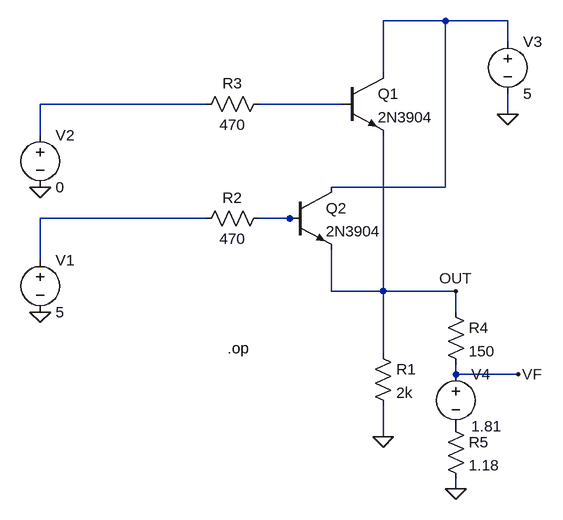
[diagram p0: schematic ORGATE.asc]
ORGATE.asc, the LTspice schematic file:
Version 4
SHEET 1 880 708
WIRE 400 -32 304 -32
WIRE 496 -32 400 -32
WIRE 496 0 496 -32
WIRE 304 48 304 -32
WIRE 32 96 -224 96
WIRE 240 96 112 96
WIRE 496 112 496 80
WIRE -224 144 -224 96
WIRE 400 224 400 -32
WIRE 400 224 224 224
WIRE 32 272 -224 272
WIRE 160 272 112 272
WIRE 176 272 160 272
WIRE -224 336 -224 272
WIRE 224 384 224 320
WIRE 304 384 304 144
WIRE 304 384 224 384
WIRE 416 384 304 384
WIRE 416 416 416 384
WIRE 304 480 304 384
WIRE 416 512 416 496
WIRE 512 512 416 512
WIRE 304 608 304 560
WIRE 416 688 416 672
FLAG 304 608 0
FLAG -224 224 0
FLAG -224 416 0
FLAG 496 112 0
FLAG 416 384 OUT
FLAG 416 688 0
FLAG 512 512 VF
SYMBOL npn 240 48 R0
SYMATTR InstName Q1
SYMATTR Value 2N3904
SYMBOL npn 160 224 R0
SYMATTR InstName Q2
SYMATTR Value 2N3904
SYMBOL res 288 464 R0
SYMATTR InstName R1
SYMATTR Value 2k
SYMBOL res 128 256 R90
WINDOW 0 0 56 VBottom 2
WINDOW 3 32 56 VTop 2
SYMATTR InstName R2
SYMATTR Value 470
SYMBOL res 128 80 R90
WINDOW 0 0 56 VBottom 2
WINDOW 3 32 56 VTop 2
SYMATTR InstName R3
SYMATTR Value 470
SYMBOL voltage -224 320 R0
WINDOW 123 0 0 Left 0
WINDOW 39 0 0 Left 0
SYMATTR InstName V1
SYMATTR Value 5
SYMBOL voltage -224 128 R0
WINDOW 123 0 0 Left 0
WINDOW 39 0 0 Left 0
SYMATTR InstName V2
SYMATTR Value 0
SYMBOL voltage 496 -16 R0
WINDOW 123 0 0 Left 0
WINDOW 39 0 0 Left 0
SYMATTR InstName V3
SYMATTR Value 5
SYMBOL res 400 400 R0
SYMATTR InstName R4
SYMATTR Value 150
SYMBOL res 400 576 R0
SYMATTR InstName R5
SYMATTR Value 1.18
SYMBOL voltage 416 496 R0
WINDOW 123 0 0 Left 0
WINDOW 39 0 0 Left 0
SYMATTR InstName V4
SYMATTR Value 1.81
TEXT 64 472 Left 2 !.op

The netlist it stands for:
* ORGATE.asc
Q1 N001 N003 OUT 0 2N3904
Q2 N001 N005 OUT 0 2N3904
R1 OUT 0 2k
R2 N005 N004 470
R3 N003 N002 470
V1 N004 0 5
V2 N002 0 0
V3 N001 0 5
R4 OUT VF 150
R5 P001 0 1.18
V4 VF P001 1.81
.model NPN NPN
.model PNP PNP
.lib standard.bjt
.op
.backanno
.end